# Altium schematic sheet B100 Block Diagram.SchDoc: B100 Block Diagram
size 393 x 281 mm; DocumentNumber: 1; SheetNumber: 1; SheetTotal: 44
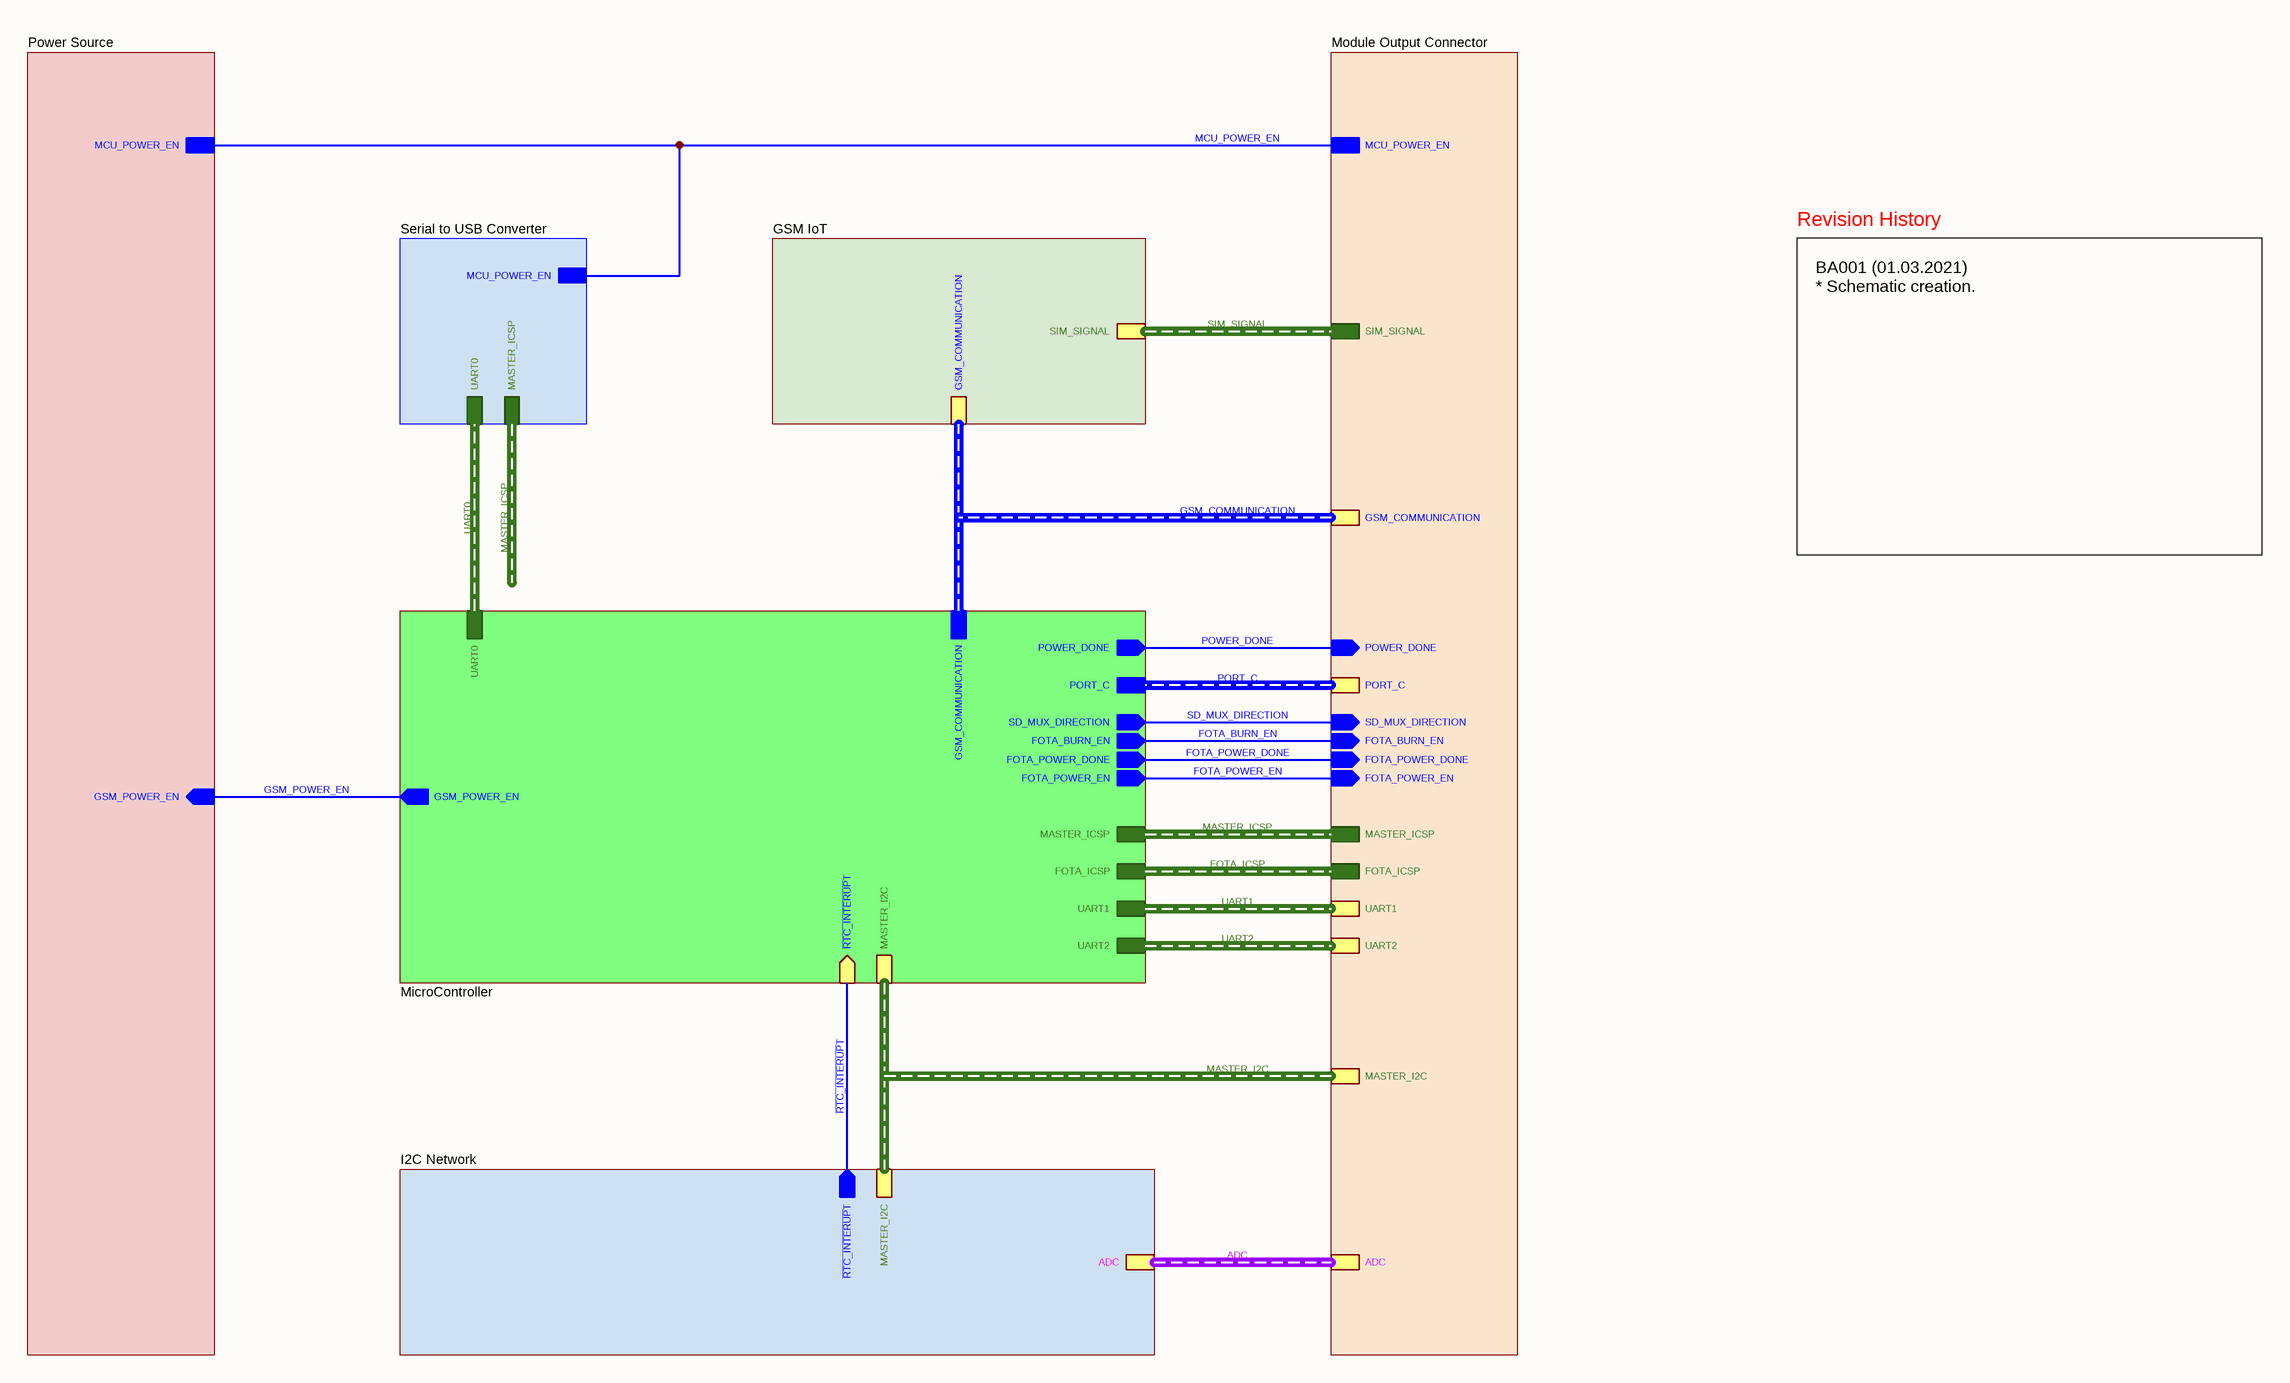
[diagram p0: B100 Block Diagram.SchDoc]

## Sub-sheets
GSM IoT = GSM IoT Block Diagram.SchDoc: SIM_SIGNAL (harness SIM_SIGNAL), GSM_COMMUNICATION (harness GSM_COMMUNICATION)
I2C Network = I2C Network.SchDoc: MASTER_I2C (harness MASTER_I2C), ~{RTC_INTERUP}T (out), ADC (harness ADC)
MicroController = MicroController.SchDoc: MASTER_I2C (harness MASTER_I2C), ~{RTC_INTERUP}T (in), UART1 (harness UART1), UART2 (harness UART2), POWER_DONE (out), GSM_COMMUNICATION (harness GSM_COMMUNICATION), PORT_C (harness PORT_C), GSM_POWER_EN (out), UART0 (harness UART0), MASTER_ICSP (harness MASTER_ICSP), FOTA_ICSP (harness FOTA_ICSP), SD_MUX_DIRECTION (out), FOTA_BURN_EN (out), FOTA_POWER_DONE (out), FOTA_POWER_EN (out)
Module Output Connector = Module Output Connector.SchDoc: FOTA_ICSP (harness FOTA_ICSP), SIM_SIGNAL (harness SIM_SIGNAL), UART2 (harness UART2), GSM_COMMUNICATION (harness GSM_COMMUNICATION), ADC (harness ADC), MASTER_ICSP (harness MASTER_ICSP), MASTER_I2C (harness MASTER_I2C), UART1 (harness UART1), MCU_POWER_EN, PORT_C (harness PORT_C), POWER_DONE (in), SD_MUX_DIRECTION (in), FOTA_BURN_EN (in), FOTA_POWER_EN (in), FOTA_POWER_DONE (in)
Power Source = Power Source.SchDoc: GSM_POWER_EN (in), MCU_POWER_EN
Serial to USB Converter = Serial to USB Converter.SchDoc: UART0 (harness UART0), MASTER_ICSP (harness MASTER_ICSP), MCU_POWER_EN

## Nets
~{RTC_INTERUP}T: sheet MicroController/~{RTC_INTERUP}T, sheet I2C Network/~{RTC_INTERUP}T
FOTA_BURN_EN: sheet MicroController/FOTA_BURN_EN, sheet Module Output Connector/FOTA_BURN_EN
FOTA_POWER_DONE: sheet MicroController/FOTA_POWER_DONE, sheet Module Output Connector/FOTA_POWER_DONE
FOTA_POWER_EN: sheet MicroController/FOTA_POWER_EN, sheet Module Output Connector/FOTA_POWER_EN
GSM_POWER_EN: sheet Power Source/GSM_POWER_EN, sheet MicroController/GSM_POWER_EN
MCU_POWER_EN: sheet Power Source/MCU_POWER_EN, sheet Module Output Connector/MCU_POWER_EN, sheet Serial to USB Converter/MCU_POWER_EN
POWER_DONE: sheet MicroController/POWER_DONE, sheet Module Output Connector/POWER_DONE
SD_MUX_DIRECTION: sheet MicroController/SD_MUX_DIRECTION, sheet Module Output Connector/SD_MUX_DIRECTION

## Buses and harness runs
harness ADC = sheet I2C Network/ADC = sheet Module Output Connector/ADC
harness FOTA_ICSP = sheet MicroController/FOTA_ICSP = sheet Module Output Connector/FOTA_ICSP
harness GSM_COMMUNICATION = sheet GSM IoT/GSM_COMMUNICATION = sheet MicroController/GSM_COMMUNICATION = sheet Module Output Connector/GSM_COMMUNICATION
harness MASTER_I2C = sheet I2C Network/MASTER_I2C = sheet MicroController/MASTER_I2C = sheet Module Output Connector/MASTER_I2C
harness MASTER_ICSP = sheet MicroController/MASTER_ICSP = sheet Module Output Connector/MASTER_ICSP
harness MASTER_ICSP = sheet Serial to USB Converter/MASTER_ICSP
harness PORT_C = sheet MicroController/PORT_C = sheet Module Output Connector/PORT_C
harness SIM_SIGNAL = sheet GSM IoT/SIM_SIGNAL = sheet Module Output Connector/SIM_SIGNAL
harness UART0 = sheet MicroController/UART0 = sheet Serial to USB Converter/UART0
harness UART1 = sheet MicroController/UART1 = sheet Module Output Connector/UART1
harness UART2 = sheet MicroController/UART2 = sheet Module Output Connector/UART2

## Notes on the sheet
- Revision History
- BA001 (01.03.2021)
  * Schematic creation.
- © 2021 All rights reserved.
  This document may not, in whole or in part, be copied, photocopied, reproduced, translated or converted to any electronic or machine readable from without prior written permission of Mehmet Günce Akkoyun.
  Engineer contact : akkoyun@me.com
- Property of
- Engineer :
- Date :
- Size :
- A3
- Time :
- Project :
- Page :
- /
- Customer :
- Product ID :
- Module ID :
- Version :
- File :
- Revision :